# EasyEDA Pro project ProPrj_red-panda-afm_2025-05-21.epro, schematic OPU_Schematic

## Sheets
1 OPU_FPC_Connector: Board Name: OPU_Driver; Create Date: 2024-12-08; Page Name: OPU_FPC_Connector; Project Name: red-panda-afm; Schematic Name: OPU_Schematic; Update Date: 2025-01-25; Company: 嘉立创EDA; Page Size: A4; Version: V1.0
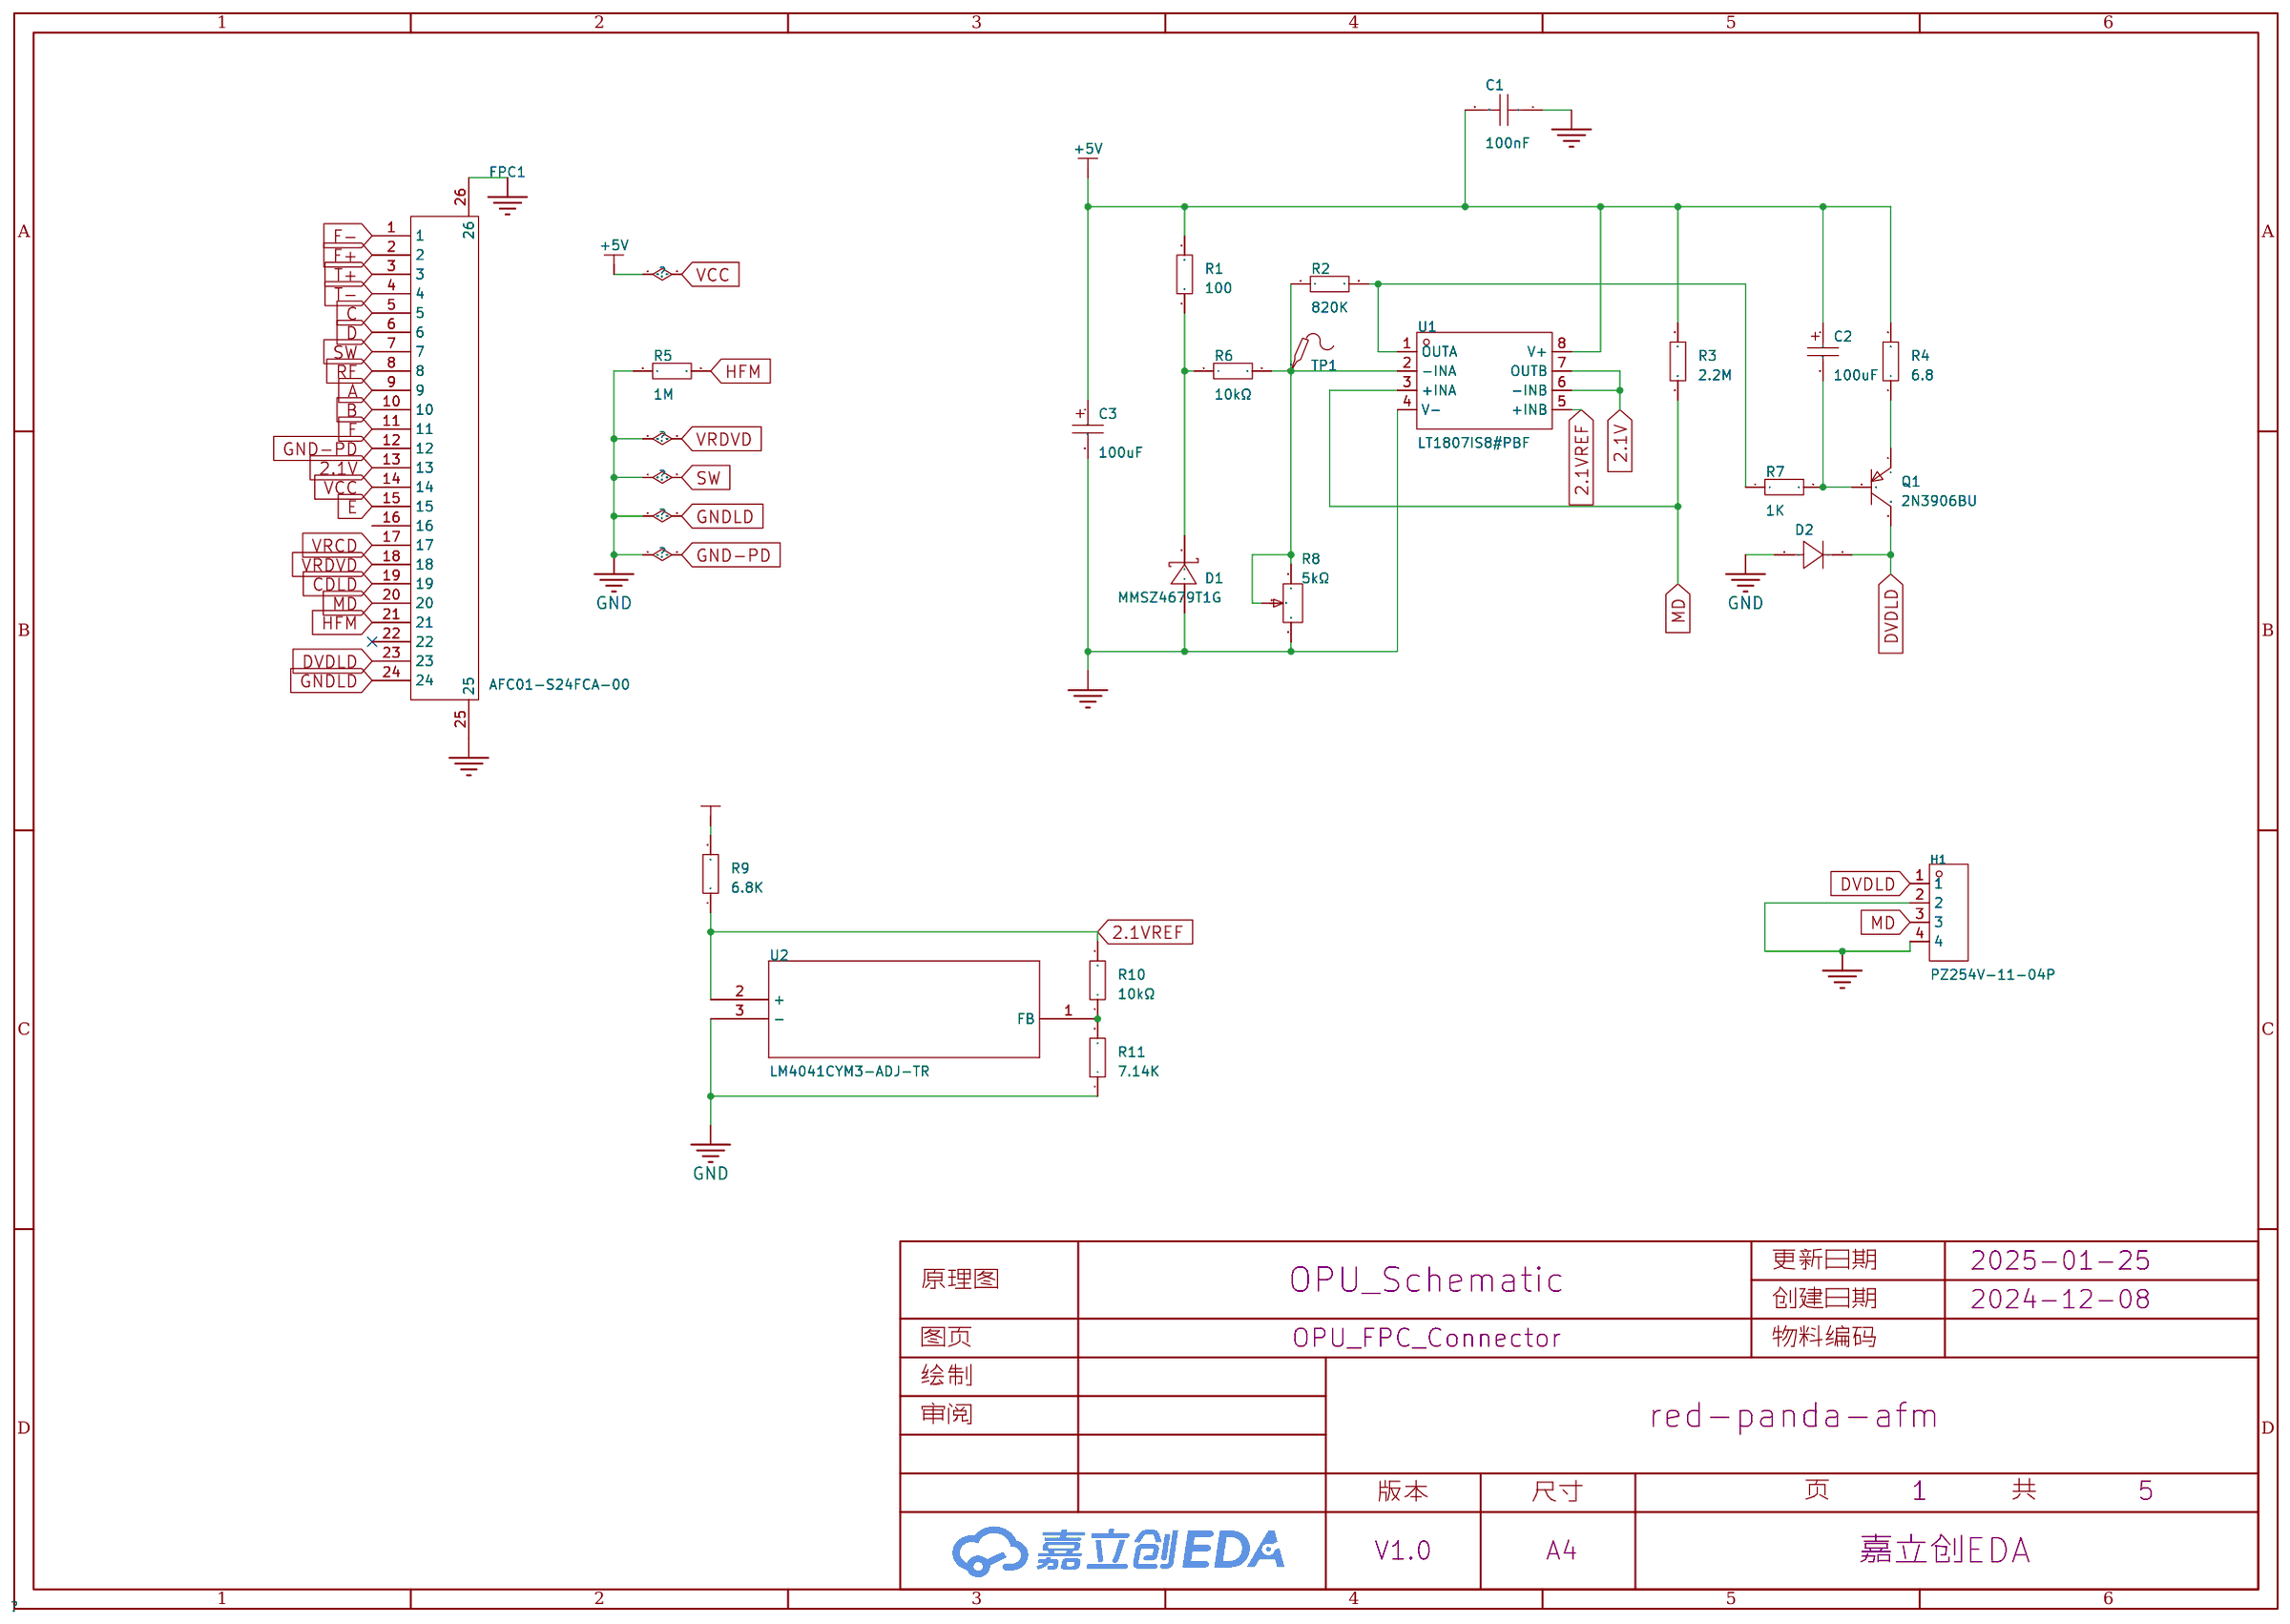
[diagram p4: OPU_FPC_Connector]
2 Voice_Coil_Driver: Page Name: Voice_Coil_Driver; Update Date: 2025-01-12
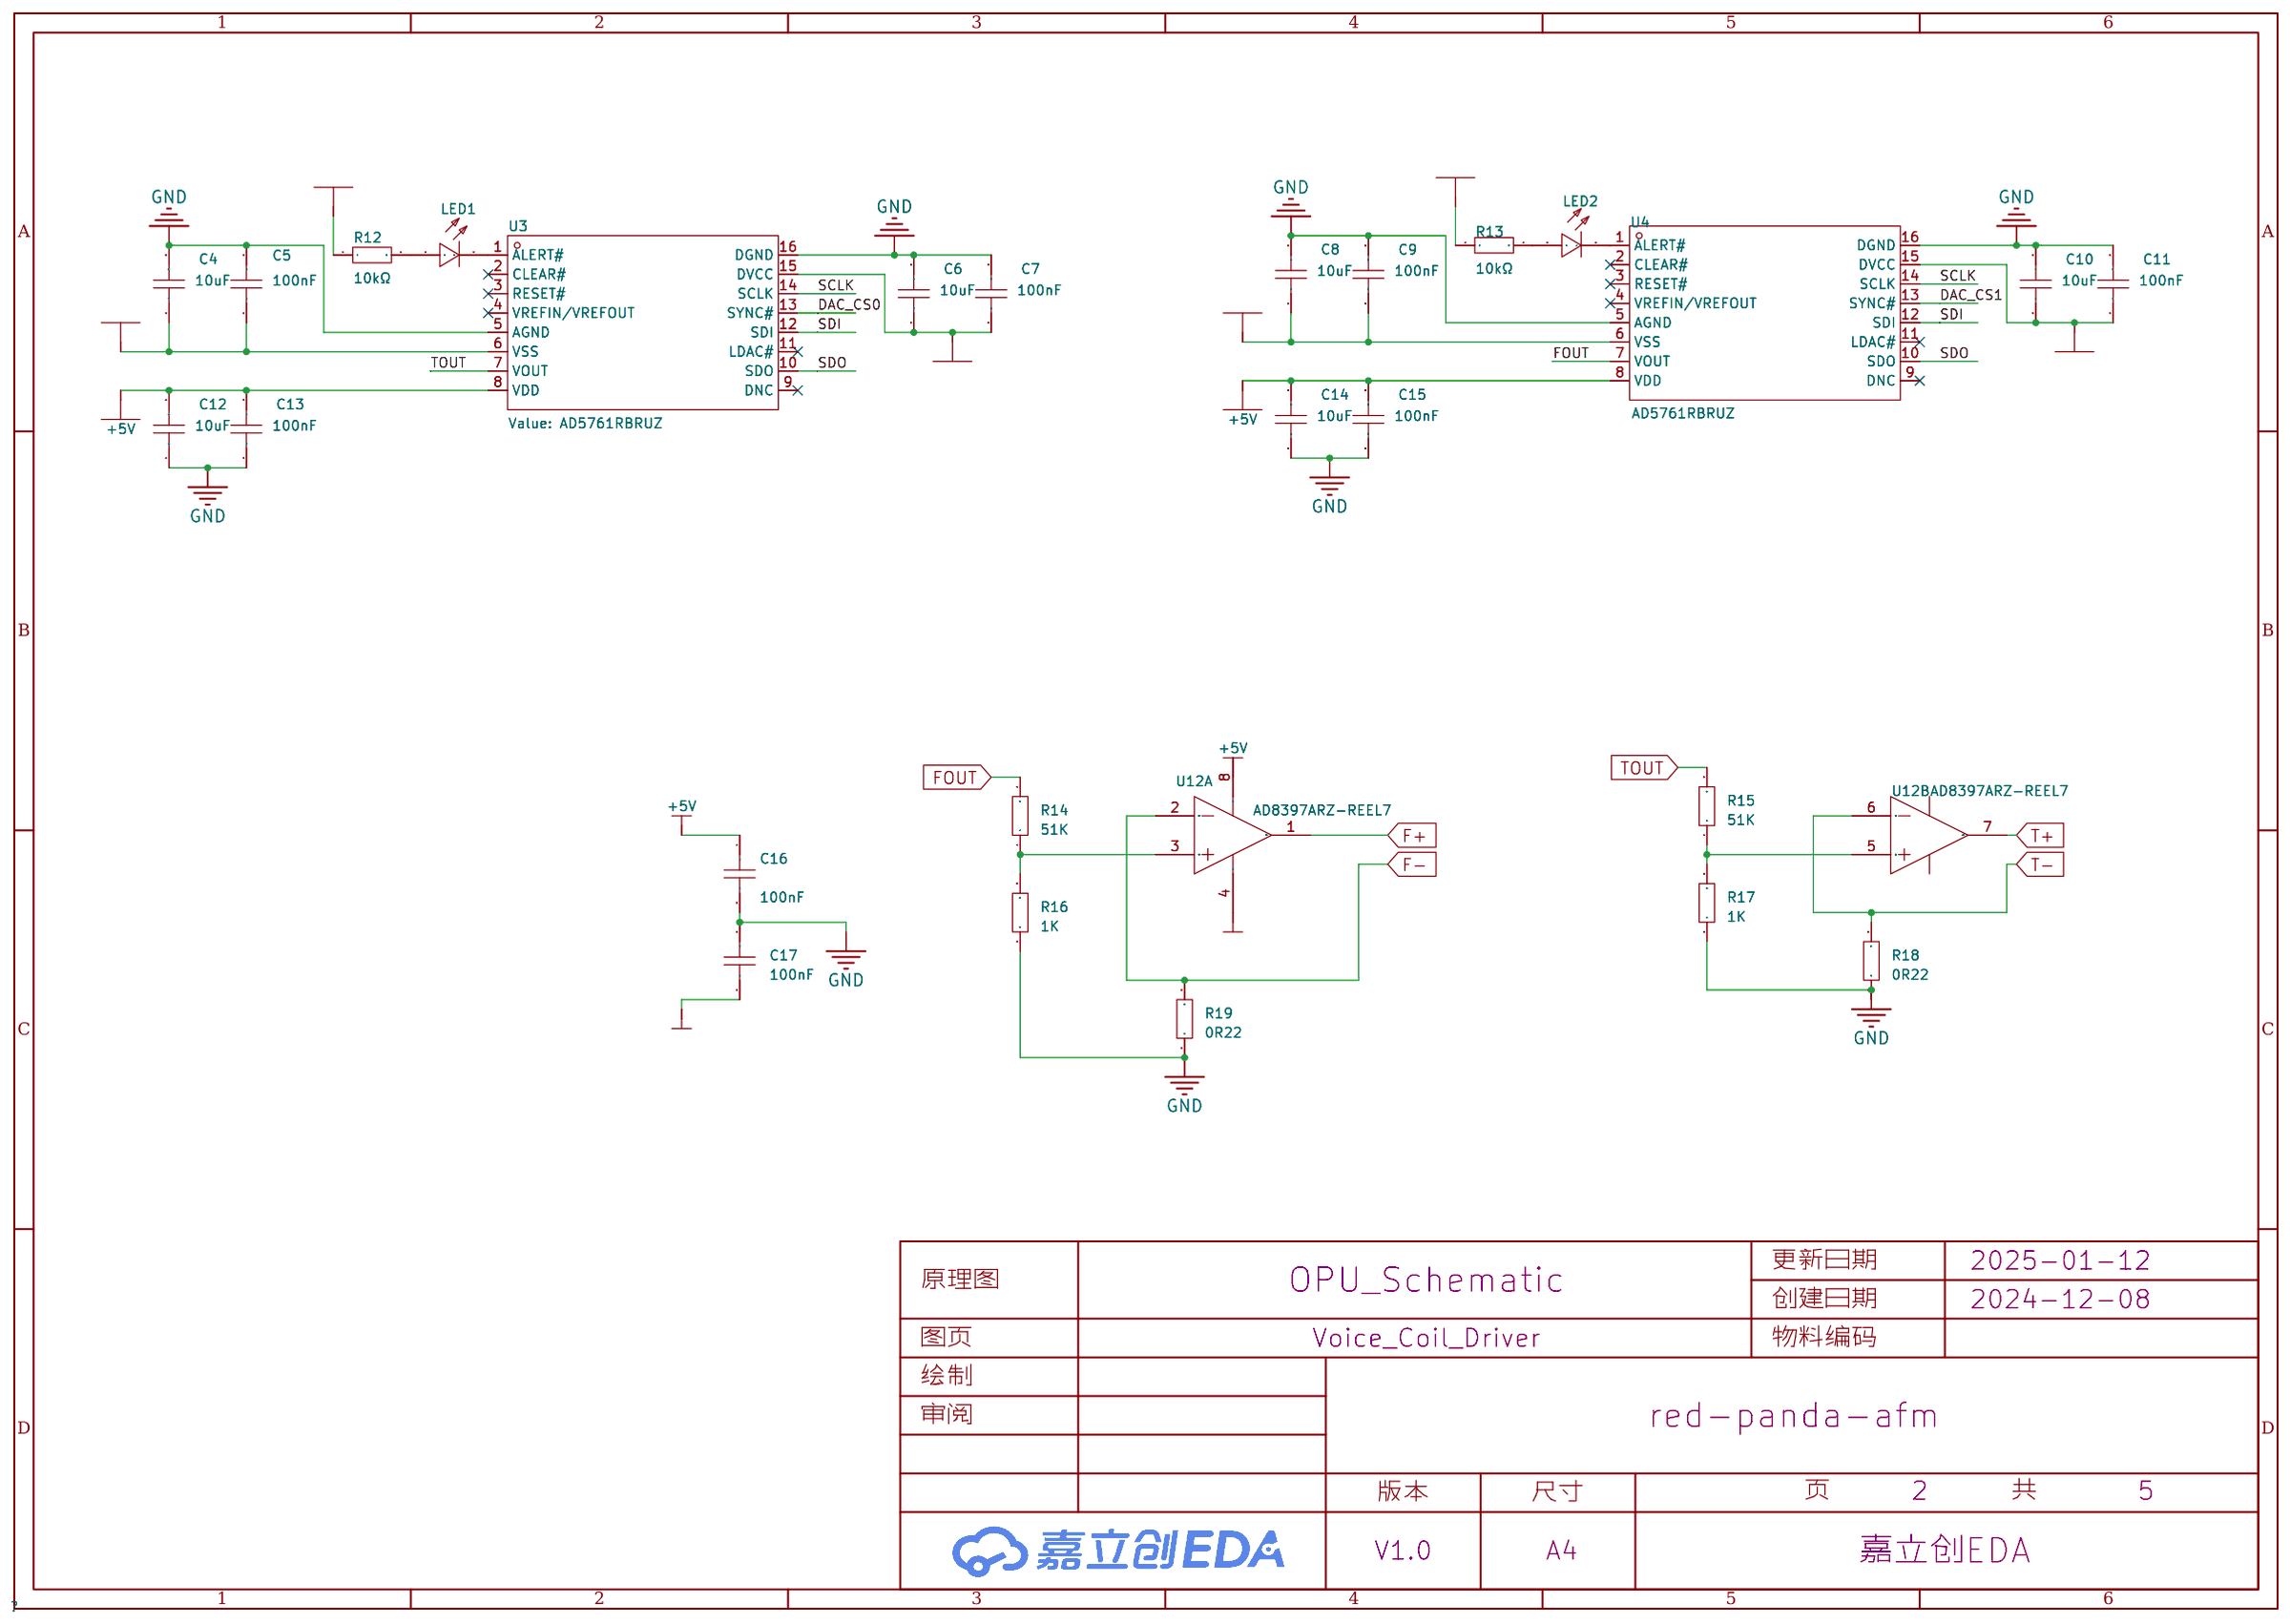
[diagram p5: Voice_Coil_Driver]
3 FocusErr: Page Name: FocusErr; Update Date: 2025-01-20
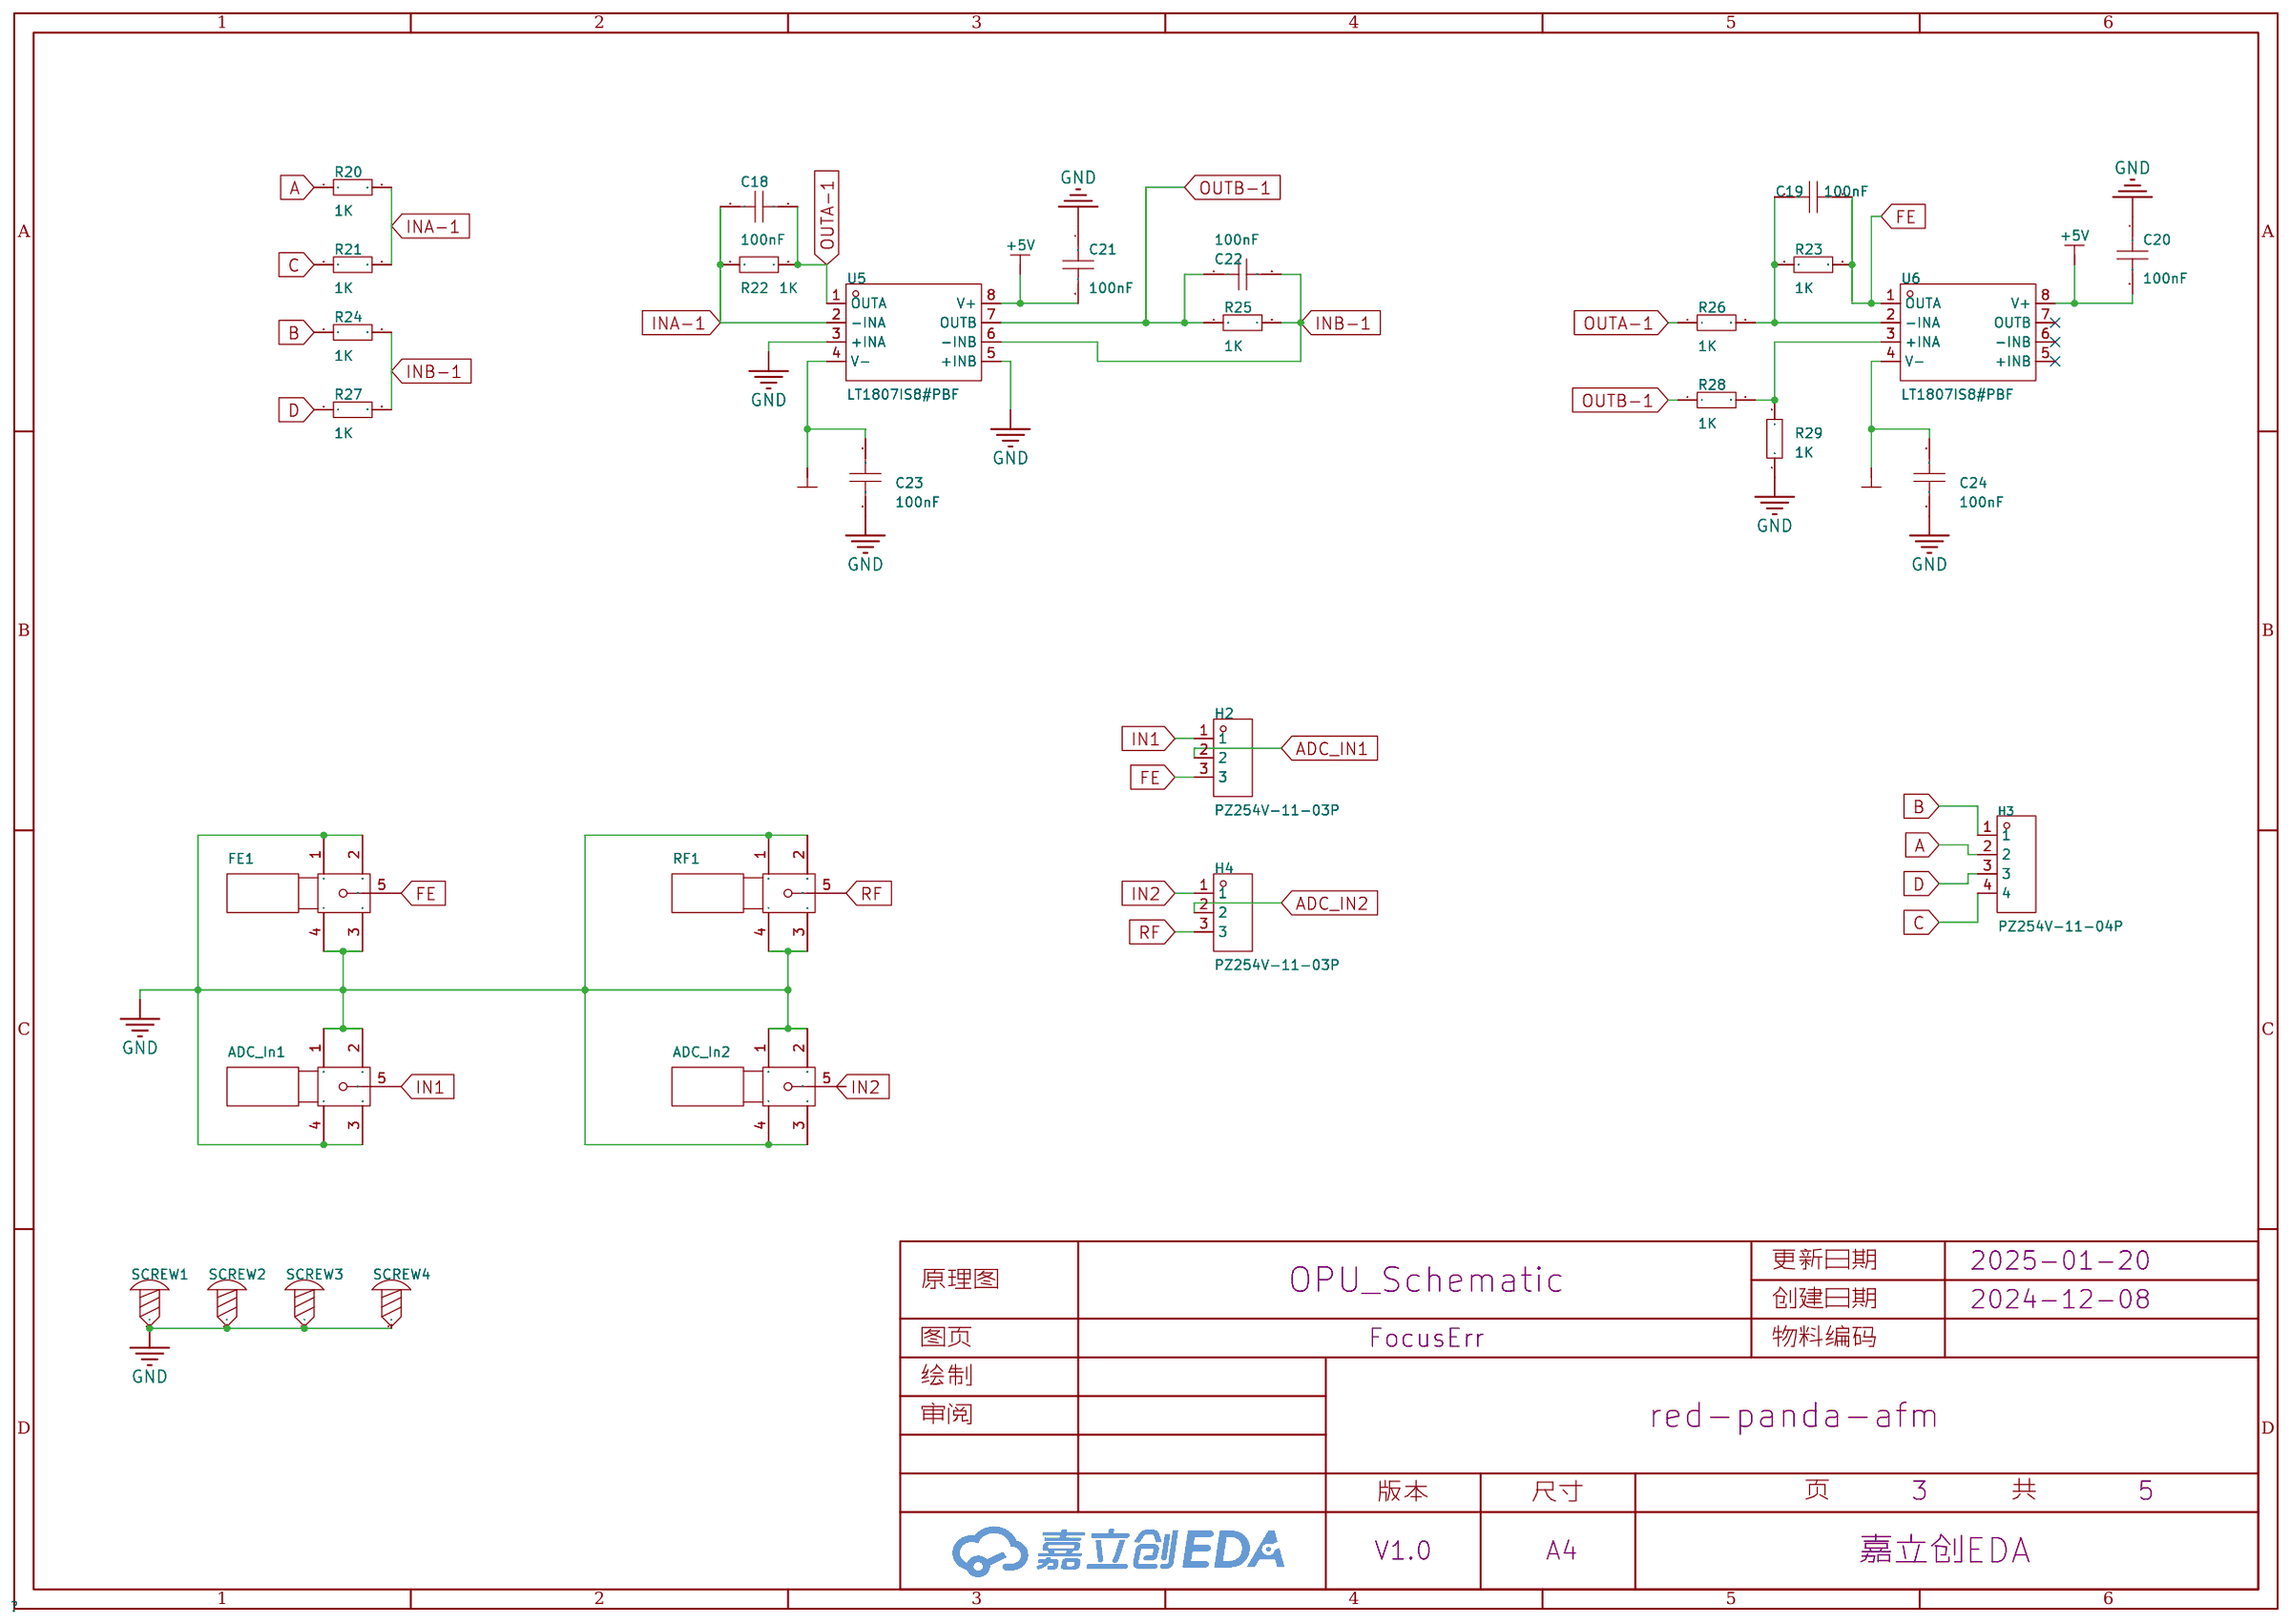
[diagram p6: FocusErr]
4 ADC_Power: Create Date: 2024-12-12; Page Name: ADC_Power; Update Date: 2025-01-20
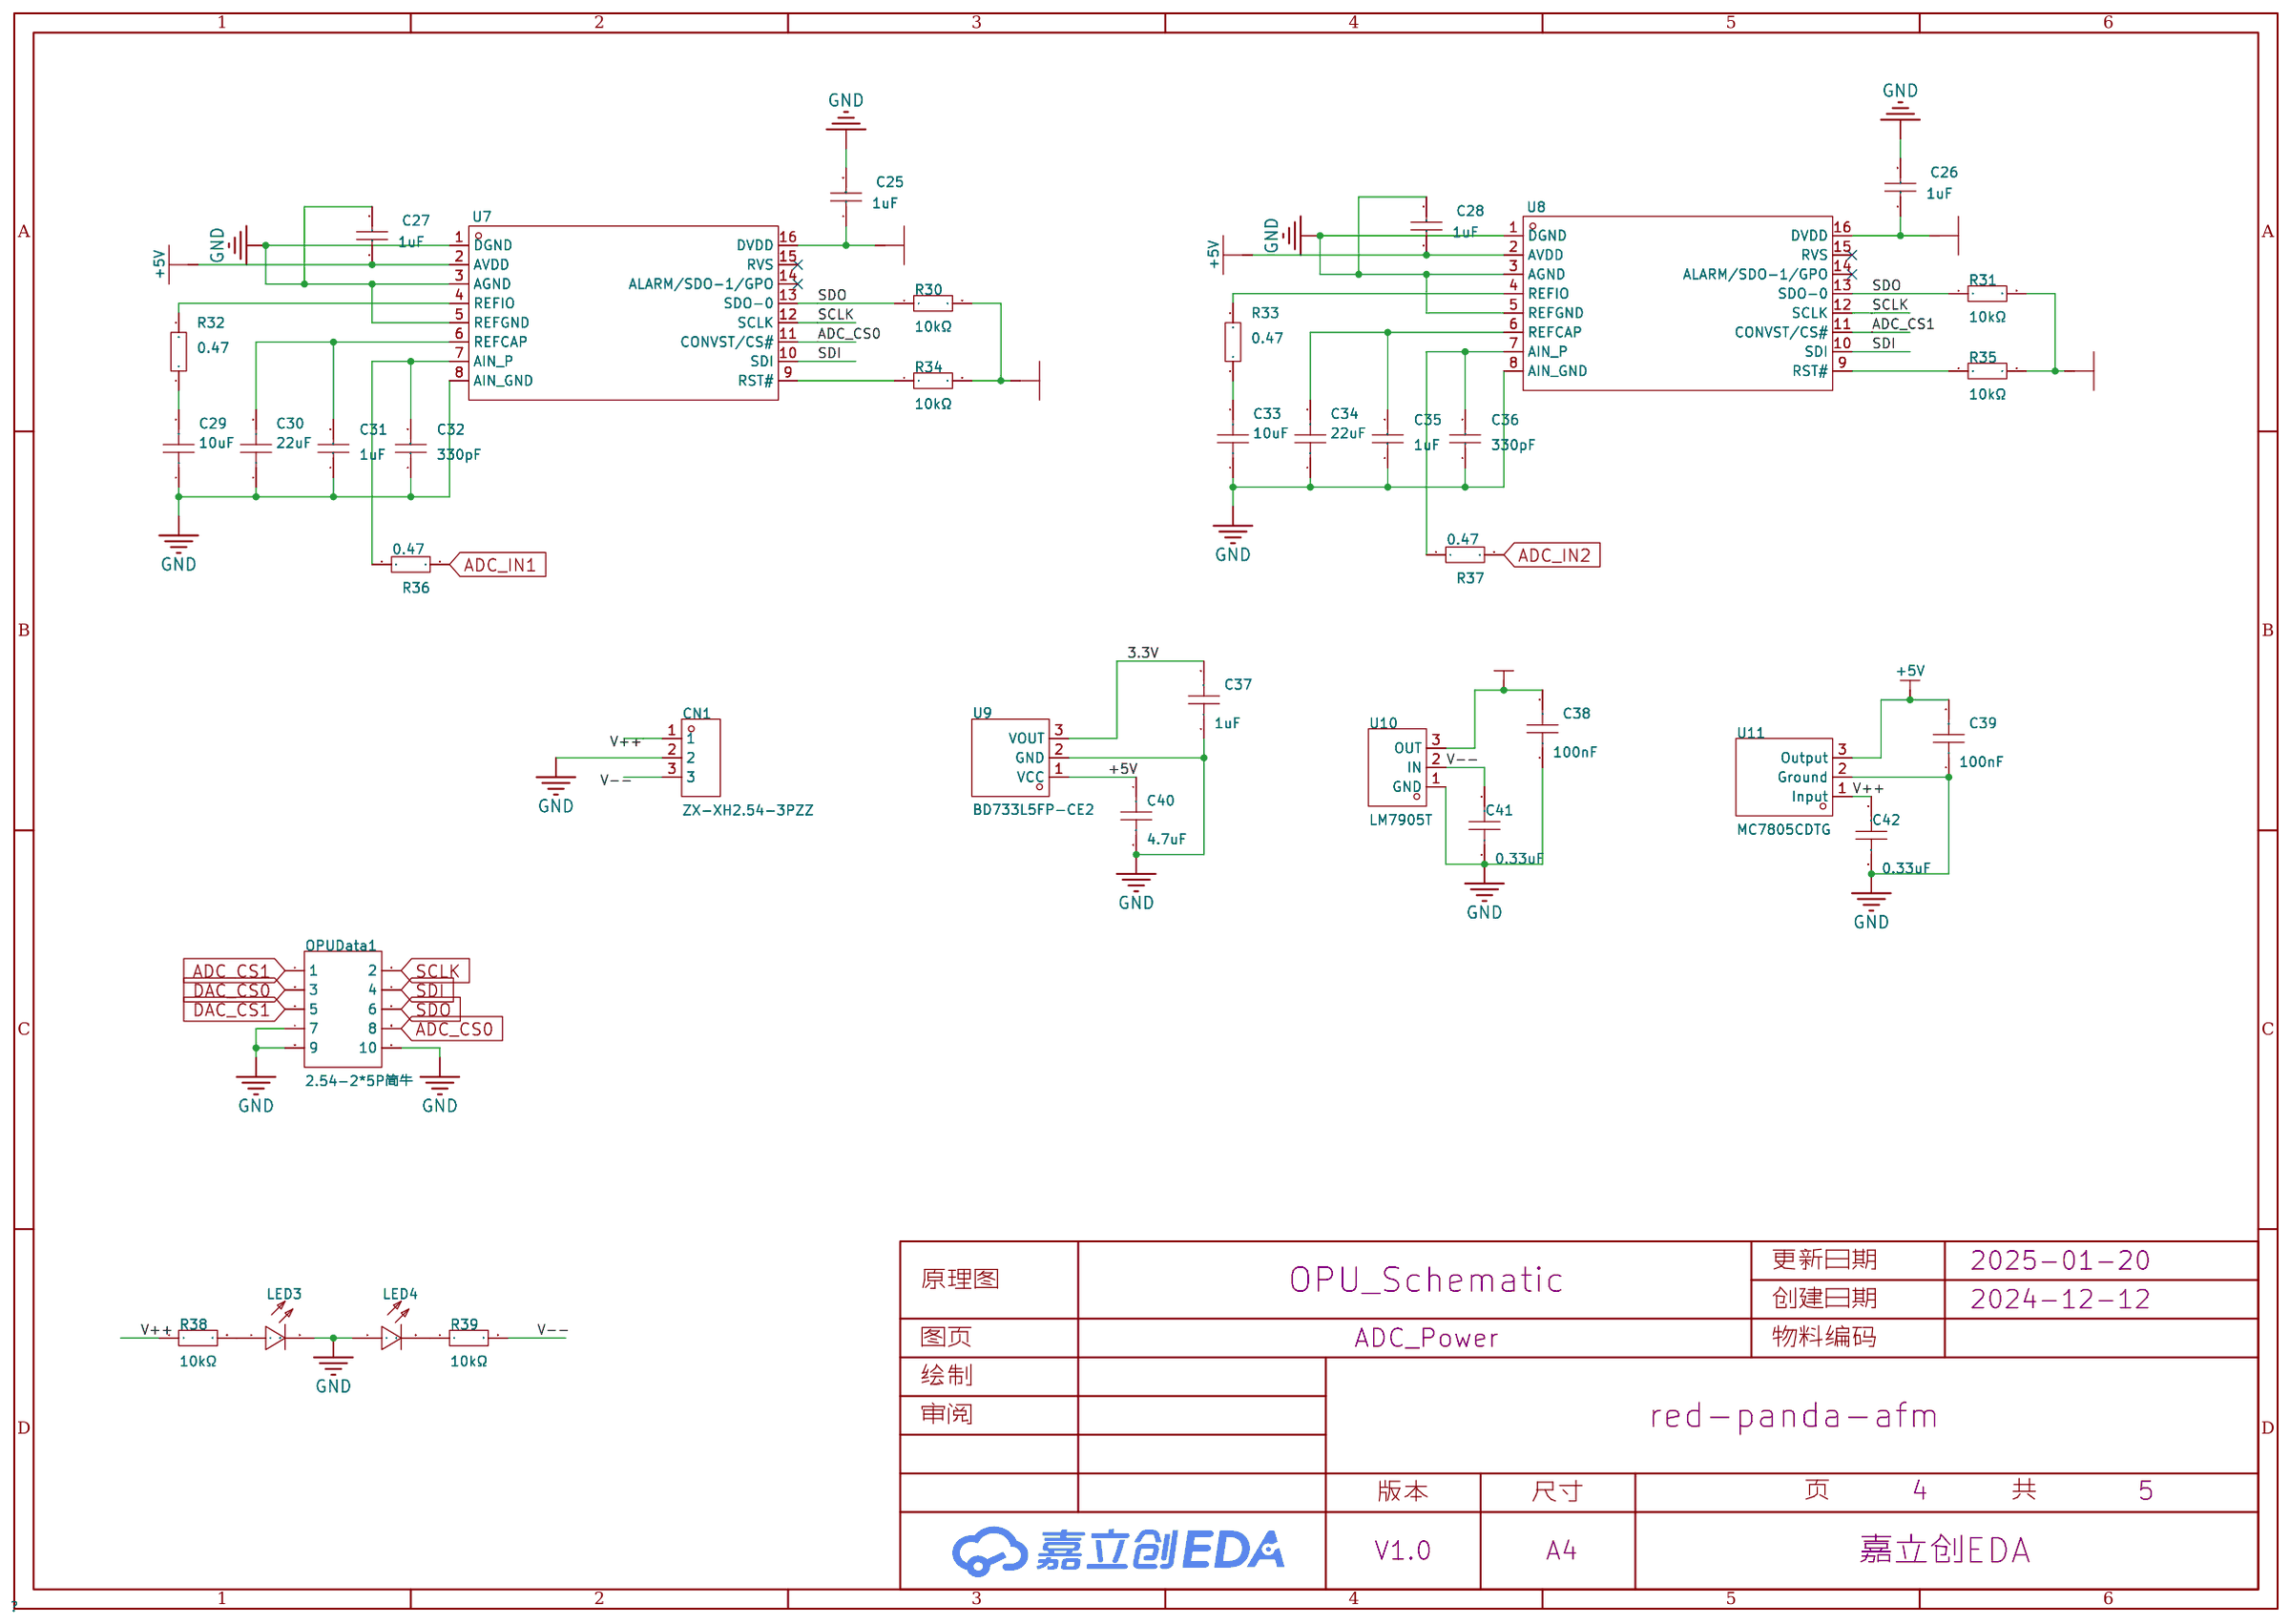
[diagram p7: ADC_Power]

## Parts
sheet ADC_Power
C25  1uF  [C0603]
C26  1uF  [C0603]
C27  1uF  [C0603]
C28  1uF  [C0603]
C29  10uF  [C0603]
C30  22uF  [C0603]
C31  1uF  [C0603]
C32  330pF  [C0603]
C33  10uF  [C0603]
C34  22uF  [C0603]
C35  1uF  [C0603]
C36  330pF  [C0603]
C37  1uF  [C0603]
C38  100nF  [C0603]
C39  100nF  [C0603]
C40  4.7uF  [C0603]
C41  0.33uF  [C0603]
C42  0.33uF  [C0603]
CN1  ZX-XH2.54-3PZZ  [CONN-TH_3P-P2.54_2501S-3P]
LED3  -  [LED0603-R-RD]
LED4  -  [LED0603-R-RD]
OPUData1  2.54-2*5P简牛  [IDC-TH_10P-P2.54_C5665]
R30  10kΩ  [R0603]
R31  10kΩ  [R0603]
R32  0.47  [R0603]
R33  0.47  [R0603]
R34  10kΩ  [R0603]
R35  10kΩ  [R0603]
R36  0.47  [R0603]
R37  0.47  [R0603]
R38  10kΩ  [R0603]
R39  10kΩ  [R0603]
U7  -  [TSSOP-16_L5.0-W4.4-P0.65-LS6.4-TL]
U8  -  [TSSOP-16_L5.0-W4.4-P0.65-LS6.4-TL]
U9  BD733L5FP-CE2  [TO-252-3L_L6.6-W6.1-P4.60-LS9.5-BR-CW]
U10  LM7905T  [TO-220-3_L10.0-W4.5-P2.54-L]
U11  MC7805CDTG  [DPAK_L6.6-W6.2-P2.29-LS9.7-BR]
sheet FocusErr
ADC_In1  -  [SMA-TH_KH-SMA-KE-Z]
ADC_In2  -  [SMA-TH_KH-SMA-KE-Z]
C18  100nF  [C0603]
C19  100nF  [C0603]
C20  100nF  [C0603]
C21  100nF  [C0603]
C22  100nF  [C0603]
C23  100nF  [C0603]
C24  100nF  [C0603]
FE1  -  [SMA-TH_KH-SMA-KE-Z]
H2  PZ254V-11-03P  [HDR-TH_3P-P2.54-V-M]
H3  PZ254V-11-04P  [HDR-TH_4P-P2.54-V-M]
H4  PZ254V-11-03P  [HDR-TH_3P-P2.54-V-M]
R20  1K  [R0603]
R21  1K  [R0603]
R22  1K  [R0603]
R23  1K  [R0603]
R24  1K  [R0603]
R25  1K  [R0603]
R26  1K  [R0603]
R27  1K  [R0603]
R28  1K  [R0603]
R29  1K  [R0603]
RF1  -  [SMA-TH_KH-SMA-KE-Z]
SCREW1  -  [Screw-Hole-M3]
SCREW2  -  [Screw-Hole-M3]
SCREW3  -  [Screw-Hole-M3]
SCREW4  -  [Screw-Hole-M3]
U5  LT1807IS8#PBF  [SOIC-8_L4.9-W3.9-P1.27-LS6.0-BL]
U6  LT1807IS8#PBF  [SOIC-8_L4.9-W3.9-P1.27-LS6.0-BL]
sheet OPU_FPC_Connector
C1  100nF  [C0603]
C2  100uF  [C2917]
C3  100uF  [C2917]
D1  MMSZ4679T1G  [SOD-123_L2.7-W1.6-LS3.7-RD-1]
D2  -  [DO-41_BD2.4-L4.7-P8.70-D0.9-RD]
FPC1  AFC01-S24FCA-00  [FPC-SMD_P0.50-24P_FGS-XJ-H2.0]
H1  PZ254V-11-04P  [HDR-TH_4P-P2.54-V-M]
Q1  2N3906BU  [TO-92-3_L4.8-W3.7-P2.54-L]
R1  100  [R0603]
R2  820K  [R0603]
R3  2.2M  [R0603]
R4  6.8  [R0603]
R5  1M  [R0603]
R6  10kΩ  [R0603]
R7  1K  [R0603]
R8  5kΩ  [RES-ADJ-TH_3296W]
R9  6.8K  [R0603]
R10  10kΩ  [R0603]
R11  7.14K  [R0603]
TP1  -  [Test-Point-0.5mm]
U1  LT1807IS8#PBF  [SOIC-8_L4.9-W3.9-P1.27-LS6.0-BL]
U2  LM4041CYM3-ADJ-TR  [SOT-23_M3_MCH]
sheet Voice_Coil_Driver
C4  10uF  [C0603]
C5  100nF  [C0603]
C6  10uF  [C0603]
C7  100nF  [C0603]
C8  10uF  [C0603]
C9  100nF  [C0603]
C10  10uF  [C0603]
C11  100nF  [C0603]
C12  10uF  [C0603]
C13  100nF  [C0603]
C14  10uF  [C0603]
C15  100nF  [C0603]
C16  100nF  [C0603]
C17  100nF  [C0603]
LED1  -  [LED0603-R-RD]
LED2  -  [LED0603-R-RD]
R12  10kΩ  [R0603]
R13  10kΩ  [R0603]
R14  51K  [R0603]
R15  51K  [R0603]
R16  1K  [R0603]
R17  1K  [R0603]
R18  0R22  [R0603]
R19  0R22  [R0603]
U3  AD5761RBRUZ  [TSSOP-16_L5.0-W4.4-P0.65-LS6.4-TL]
U4  AD5761RBRUZ  [TSSOP-16_L5.0-W4.4-P0.65-LS6.4-TL]
U12  AD8397ARZ-REEL7  [SOIC-8_L4.9-W3.9-P1.27-LS6.0-BL]  (sections 1,2)

## Library data of the parts
C25-C28 C31 C35 = CL10A105KA8NNNC: 容值:1uF;精度:±10%;额定电压:25V;温度系数:X5R;; LCSC Part Name: 1uF ±10% 25V; Supplier Part: C5673; Manufacturer: SAMSUNG(三星); Supplier Footprint: 0603; JLCPCB Part Class: Extended Part; Datasheet: https://atta.szlcsc.com/upload/public/pdf/source/20160103/1457707739994.pdf; Supplier: LCSC; Tolerance: ±10%; Voltage Rated: 25V; Temperature Coefficient: X5R
C4 C6 C8 C10 C12 C14 C29 C33 = GRM188R61E106MA73D: 容值:10uF;精度:±20%;额定电压:25V;温度系数:X5R;; LCSC Part Name: 10uF ±20% 25V; Supplier Part: C91606; Manufacturer: muRata(村田); Supplier Footprint: 0603; JLCPCB Part Class: Extended Part; Datasheet: https://atta.szlcsc.com/upload/public/pdf/source/20161226/1482720176185.pdf; Supplier: LCSC; Tolerance: ±20%; Voltage Rated: 25V; Temperature Coefficient: X5R
C30 C34 = CL10A226MP8NUNE: 容值:22uF;精度:±20%;额定电压:10V;温度系数:X5R;; LCSC Part Name: 22uF ±20% 10V; Supplier Part: C86295; Manufacturer: SAMSUNG(三星); Supplier Footprint: 0603; JLCPCB Part Class: Extended Part; Datasheet: https://atta.szlcsc.com/upload/public/pdf/source/20170325/1490427882169.pdf; Supplier: LCSC; Tolerance: ±20%; Voltage Rated: 10V; Temperature Coefficient: X5R
C32 C36 = CL10C331JB8NNNC: 容值:330pF;精度:±5%;额定电压:50V;温度系数:C0G;; LCSC Part Name: 330pF ±5% 50V; Supplier Part: C1664; Manufacturer: SAMSUNG(三星); Supplier Footprint: 0603; JLCPCB Part Class: Basic Part; Datasheet: https://atta.szlcsc.com/upload/public/pdf/source/20160103/1457707688612.pdf; Supplier: LCSC; Tolerance: ±5%; Voltage Rated: 50V; Temperature Coefficient: C0G
C37 C40-C42 = CAP_0603: Supplier Footprint: 0603
C1 C5 C7 C9 C11 C13 C15-C24 C38 C39 = GCM188R11H104KA42D: Capacitance: Tolerance:±10% Tolerance:±10% Voltage Rated:- Temperature Coefficient:; LCSC Part Name: 100nF ±10%; Supplier Part: C913754; Manufacturer: muRata(村田); Supplier Footprint: 0603; JLCPCB Part Class: Extended Part; Datasheet: https://atta.szlcsc.com/upload/public/pdf/source/20201110/C913436_BC89257AF1CC170DEC759F9C1F15D7BC.pdf; Supplier: LCSC; Tolerance: ±10%
CN1 = ZX-XH2.54-3PZZ: Pins Structure:1x3P Pitch:2.54mm Mounting Style:Straight Reference Series:XH Number of Pins:3P Number of Rows:1 Number of PINs Per Row:3 Row Spacing:- Current Rating (Max):3A Contact Material:Brass Contact Plating:Tin Operating Temperature Range:-25℃~+85℃; Supplier Part: C7429633; Manufacturer: Megastar(兆星); Supplier Footprint: 插件,P=2.54mm; JLCPCB Part Class: Extended Part; Datasheet: https://atta.szlcsc.com/upload/public/pdf/source/20230619/AE17037A2CFDBE8D9CBA775D61AD0A84.pdf; Supplier: LCSC; Pins Structure: 1x3P; Pitch: 2.54mm; Mounting Style: Straight; Reference Series: XH; Number of Pins: 3P; Number of Rows: 1; Number of PINs Per Row: 3; Current Rating (Max): 3A; Contact Material: Brass; Contact Plating: Tin; Operating Temperature Range: -25℃~+85℃
LED1-LED4 = 19-217/R6C-AL1M2VY/3T: 发光颜色:红灯;二极管配置:-;透镜颜色:无色透明;主波长:617.5nm;峰值波长:632nm;色温:-;光通量(25时):-;测试电流:5mA;正向电压(VF):2.2V;发光强度:28.5mcd;功率:60mW;发光角度:120°;安装方式:-;工作温度:-40~+85;; LCSC Part Name: 0603 红灯; Supplier Part: C72044; Manufacturer: EVERLIGHT(台湾亿光); Supplier Footprint: 0603; JLCPCB Part Class: Extended Part; Datasheet: https://atta.szlcsc.com/upload/public/pdf/source/20160507/1462613613821.pdf; Supplier: LCSC; Emitted Color: 红灯; Lens Color: 无色透明; Dominant Wavelength: 617.5nm; Peak Wavelength: 632nm; Forward Current: 5mA; Forward Voltage (VF): 2.2V; Luminous Intensity: 28.5mcd; Power Dissipation: 60mW; Viewing Angle: 120°; Operating Temperature: -40~+85
OPUData1 = 2.54-2*5P简牛: Connector Type:简牛座 Pitch:2.54mm Structure:2x5P Holder Type:Straight Row Spacing:2.54mm Number of Rows:2 Pin Number in each Row:5 Contact Material:- Contact Plating:-; LCSC Part Name: 2.54mm 2x5P 排数:2 每排P数:5; Supplier Part: C5665; Manufacturer: BOOMELE(博穆精密); Supplier Footprint: 插件,P=2.54mm; JLCPCB Part Class: Extended Part; Datasheet: https://atta.szlcsc.com/upload/public/pdf/source/20140331/1457707037896.pdf; Supplier: LCSC; Connector Type: 简牛座; Pitch: 2.54mm; Structure: 2x5P; Holder Type: Straight; Row Spacing: 2.54mm; Number of Rows: 2; Pin Number in each Row: 5
R6 R10 R12 R13 R30 R31 R34 R35 R38 R39 = 0603WAF1002T5E: Type:Thick Film Resistors Resistance:10kΩ Tolerance:±1% Tolerance:±1% Power(Watts): Overload Voltage (Max): Temperature Coefficient:±100ppm/℃ Temperature Coefficient:±100ppm/℃ Operating Temperature Range:-55℃~+155℃ Operating Temperature Range:-55℃~+155℃; LCSC Part Name: 厚膜电阻 10kΩ ±1% 100mW; Supplier Part: C25804; Manufacturer: UNI-ROYAL(厚声); Supplier Footprint: 0603; JLCPCB Part Class: Basic Part; Datasheet: https://atta.szlcsc.com/upload/public/pdf/source/20200306/C422600_1E6D84923E4A46A82E41ADD87F860B5C.pdf; Supplier: LCSC; Type: Thick Film Resistors; Tolerance: ±1%; Temperature Coefficient: ±100ppm/℃; Operating Temperature Range: -55℃~+155℃
R32 R33 R36 R37 = RL0603FR-070R47L: 阻值:0.47;精度:±1%;功率:100mW;温度系数:±800ppm/;; LCSC Part Name: 0.47 ±1% 100mW; Supplier Part: C326953; Manufacturer: YAGEO(国巨); Supplier Footprint: 0603; JLCPCB Part Class: Extended Part; Datasheet: https://atta.szlcsc.com/upload/public/pdf/source/20181031/C326953_2A06D5EACD581F8EE6DB7FFE6C5B8872.pdf; Supplier: LCSC; Tolerance: ±1%; Power(Watts): 100mW; Temperature Coefficient: ±800ppm/
U7 U8 = ADS8685IPWR: A/D 位数:-;采样率（sps）:-;输入数:-;输入类型:-;; Supplier Part: C2669941; Manufacturer: TI(德州仪器); Supplier Footprint: TSSOP-16; JLCPCB Part Class: Extended Part; Supplier: LCSC
U9 = BD733L5FP-CE2: Supplier Part: C509724; Manufacturer: ROHM(罗姆); Supplier Footprint: TO-252-3; JLCPCB Part Class: Extended Part; Datasheet: https://atta.szlcsc.com/upload/public/pdf/source/20230201/396DA52F76B265AFAA10405709CD3C0A.pdf; Supplier: LCSC
U10 = LM7905T: Output Voltage:5V Output Voltage:5V; Supplier Part: C2926293; Manufacturer: HGSEMI(华冠); Supplier Footprint: TO-220-3; JLCPCB Part Class: Extended Part; Datasheet: https://atta.szlcsc.com/upload/public/pdf/source/20220921/D54579C407B8098A57F5285C42DC4416.pdf; Supplier: LCSC; Output Voltage: 5V
U11 = MC7805CDTG: LCSC Part Name: 线性电压稳压器，1 A，5 至 24 V，正向; Supplier Part: C897464; Manufacturer: onsemi(安森美); Supplier Footprint: DPAK; JLCPCB Part Class: Extended Part; Datasheet: https://atta.szlcsc.com/upload/public/pdf/source/20221020/B822C9350C81A84B74CC7C0C15A8E182.pdf; Supplier: LCSC
ADC_In1 ADC_In2 FE1 RF1 = KH-SMA-KE-Z: 连接器类型:板端;射频系列:SMA;接口类型:内孔;端口数量:1;阻抗:-;频率-最大值:-;样式:正脚;接口直径:6.2mm;接口长度/高度:8mm;工作温度范围:-;; LCSC Part Name: SMA 内孔 正脚 镀金半牙H=8MM; Supplier Part: C504007; Manufacturer: kinghelm(金航标); Supplier Footprint: 插件; JLCPCB Part Class: Extended Part; Datasheet: https://atta.szlcsc.com/upload/public/pdf/source/20200330/C504007_C31FA59B5EDC95FA4ACB3324B1A20151.pdf; Supplier: LCSC; Connector Type: 板端; RF Series: SMA; Interface Type: 内孔; Number of Ports: 1; Style: 正脚; Interface Diameter: 6.2mm; Interface Length/Height: 8mm
H2 H4 = PZ254V-11-03P: Pin Structure:1x3P Pitch:2.54mm Row Spacing:- Circluar Pins/Square Pins:Square Pins Mounting Type:Straight Number of Rows:Plugin Number of Pins:3P Current Rating (Max):3A Voltage Rating (Max):250V Length of Mating Pin:6mm Insulation Height:2.5mm Length of; LCSC Part Name: 间距:2.54mm 1x3P 直插 方针; Supplier Part: C2937625; Manufacturer: XFCN(兴飞); Supplier Footprint: 插件,P=2.54mm; JLCPCB Part Class: Extended Part; Datasheet: https://atta.szlcsc.com/upload/public/pdf/source/20200309/C492402_8335C3D49C4E4C618838D59BB1D024C1.pdf; Supplier: LCSC; Pin Structure: 1x3P; Pitch: 2.54mm; Circluar Pins/Square Pins: Square Pins; Mounting Type: Straight; Number of Rows: Plugin; Number of Pins: 3P; Current Rating (Max): 3A; Voltage Rating (Max): 250V; Length of Mating Pin: 6mm; Insulation Height: 2.5mm; Length of End Connection Pin: 3mm; Operating Temperature Range: -40℃~+105℃; Color: Black
H1 H3 = PZ254V-11-04P: Pin Structure:1x4P Pitch:2.54mm Row Spacing:- Circluar Pins/Square Pins:Square Pins Mounting Type:Straight Number of Rows:Plugin Number of Pins:4P Current Rating (Max):3A Voltage Rating (Max):250V Length of Mating Pin:6mm Insulation Height:2.5mm Length of; LCSC Part Name: 间距:2.54mm 1x4P 直插 方针; Supplier Part: C2691448; Manufacturer: XFCN(兴飞); Supplier Footprint: 插件,P=2.54mm; JLCPCB Part Class: Extended Part; Datasheet: https://atta.szlcsc.com/upload/public/pdf/source/20200309/C492403_F9F19131791D08044AD4F84F8E751A34.pdf; Supplier: LCSC; Pin Structure: 1x4P; Pitch: 2.54mm; Circluar Pins/Square Pins: Square Pins; Mounting Type: Straight; Number of Rows: Plugin; Number of Pins: 4P; Current Rating (Max): 3A; Voltage Rating (Max): 250V; Length of Mating Pin: 6mm; Insulation Height: 2.5mm; Length of End Connection Pin: 3mm; Operating Temperature Range: -40℃~+105℃; Color: Black
R1-R5 R7 R9 R11 R14-R29 = Res_0603: Supplier Footprint: 0603
SCREW1-SCREW4 = Screw-Hole-M3: Supplier Footprint: 插件
U1 U5 U6 = LT1807IS8#PBF: Number of Circuits:双路 Gain Bandwidth Product(GBP):325MHz Current - Input Bias(Ib):1uA Slew Rate(SR):140V/us Output Current:85mA Output Type:- Rail to Rail:- Operating Temperature:-40℃~+85℃ Operating Temperature:-40℃~+85℃; Supplier Part: C665381; Manufacturer: ADI(亚德诺); Supplier Footprint: SOIC-8; JLCPCB Part Class: Extended Part; Datasheet: https://atta.szlcsc.com/upload/public/pdf/source/20200701/C665369_CCAA0347C2AF7A448F3B38ED65269E1E.pdf; Supplier: LCSC; Number of Circuits: 双路; Gain Bandwidth Product(GBP): 325MHz; Current - Input Bias(Ib): 1uA; Slew Rate(SR): 140V/us; Output Current: 85mA; Operating Temperature: -40℃~+85℃
C2 C3 = TAJB107K006RNJ: 容值:100uF;精度:±10%;额定电压:6.3V;等效串联电阻:1.7Ω@100kHz;; LCSC Part Name: 100uF ±10% 6.3V; Supplier Part: C16133; Manufacturer: Kyocera AVX; Supplier Footprint: CASE-B-3528-21(mm); JLCPCB Part Class: Basic Part; Datasheet: https://atta.szlcsc.com/upload/public/pdf/source/20160107/1457707750344.pdf; Supplier: LCSC; Tolerance: ±10%; Rated Voltage: 6.3V; Equivalent Series Resistance(ESR): 1.7Ω@100kHz; Operating Temperature: -55℃~+125℃
D1 = MMSZ4679T1G: Diode Configuration:Independent Type Zener Voltage (Nom):2V Reverse Leakage Current (Ir):5uA@1V Zener Voltage (Range):1.9V~2.1V Zener Voltage (Range):1.9V~2.1V Power Dissipation:500mW Zener Impedance (Zzt):-; Supplier Part: C236096; Manufacturer: onsemi(安森美); Supplier Footprint: SOD-123; JLCPCB Part Class: Extended Part; Datasheet: https://atta.szlcsc.com/upload/public/pdf/source/20190903/C236096_7D7272416DE154F9B2400A6A9634F1EE.pdf; Supplier: LCSC; Diode Configuration: Independent Type; Zener Voltage (Nom): 2V; Reverse Leakage Current (Ir): 5uA@1V; Zener Voltage (Range): 1.9V~2.1V; Power Dissipation: 500mW
D2 = 1N4007: Supplier Footprint: DO-41
FPC1 = AFC01-S24FCA-00: 锁定特性:翻盖式;触点类型:下接;触点数量:24P;间距:0.5mm;安装类型:卧贴;; LCSC Part Name: 间距:0.5mm P数:24P 翻盖式 下接; Supplier Part: C262669; Manufacturer: JS(钜硕电子); Supplier Footprint: SMD,P=0.5mm,卧贴; JLCPCB Part Class: Extended Part; Datasheet: https://atta.szlcsc.com/upload/public/pdf/source/20190816/C413942_2A72D1AC756EAE17EEDF756A339D4500.pdf; Supplier: LCSC; Locking Feature: 翻盖式; Contact Type: 下接; Number of Contacts: 24P; Pitch: 0.5mm; Mounting Type: 卧贴; FFC, FCB Thickness: 0.3mm; Height Above Board: 2mm
Q1 = 2N3906BU: 晶体管类型:PNP;集电极电流(Ic):200mA;集射极击穿电压(Vceo):40V;功率(Pd):625mW;直流电流增益(hFE@Ic,Vce):100@10mA,1.0V;; LCSC Part Name: PNP 电流:200mA 耐压:40V; Supplier Part: C124483; Manufacturer: onsemi(安森美); Supplier Footprint: TO-92-3; JLCPCB Part Class: Extended Part; Datasheet: https://atta.szlcsc.com/upload/public/pdf/source/20170804/C124483_1501836270112866294.pdf; Supplier: LCSC; Transistor Type: PNP; Collector Current (Ic): 200mA; Collector-Emitter Breakdown Voltage (Vceo): 40V; Power Dissipation (Pd): 625mW; DC Current Gain (hFE@Ic,Vce): 100@10mA,1.0V; Transition Frequency (fT): 250MHz; Collector Cut-Off Current (Icbo): 50nA; Collector-Emitter Saturation Voltage (VCE(sat)@Ic,Ib): 250mV@10mA,1.0mA; Operating Temperature: -55℃~+150℃
R8 = 3296W-1-502LF: 阻值:5kΩ;精度:±10%;; LCSC Part Name: 5kΩ ±10%; Supplier Part: C60620; Manufacturer: BOURNS; Supplier Footprint: SIP-3P,9.5x4.8mm; JLCPCB Part Class: Extended Part; Datasheet: https://atta.szlcsc.com/upload/public/pdf/source/20180326/C111793_7BE3639881F18EA7BF3D269EDA80A489.pdf; Supplier: LCSC; Tolerance: ±10%
TP1 = Test-Point: Test Point 测试点
U2 = LM4041CYM3-ADJ-TR
U3 U4 = AD5761RBRUZ: D/A 位数:-;D/A通道数:-;输出类型:-;读写接口类型:-;; Supplier Part: C404015; Manufacturer: ADI(亚德诺)/LINEAR; Supplier Footprint: TSSOP-16; JLCPCB Part Class: Extended Part; Datasheet: https://atta.szlcsc.com/upload/public/pdf/source/20190722/C404015_21C88E48C88813C7B0010A18F7ED8816.pdf; Supplier: LCSC
U12 = AD8397ARZ-REEL7: LCSC Part Name: 双通道轨到轨输出运算放大器; Supplier Part: C521305; Manufacturer: ADI(亚德诺); Supplier Footprint: SOIC-8; JLCPCB Part Class: Extended Part; Datasheet: https://atta.szlcsc.com/upload/public/pdf/source/20191204/C90876_4AF00728A23BB3AF24EDE9E3A75C9AF8.pdf; Supplier: LCSC

## Nets
2.1V: FPC1.13 U1.6(-INB) U1.7(OUTB)
2.1VREF: R9.1 R10.2 U1.5(+INB) U2.2(+)
3.3V: C6.1 C7.1 C10.1 C11.1 C25.1 C26.1 C37.2 R12.1 R13.1 R30.2 R31.2 R34.2 R35.2 U3.15(DVCC) U4.15(DVCC) U7.16(DVDD) U8.16(DVDD) U9.3(VOUT)
+5V: C1.2 C2.1 C3.1 C12.2 C13.2 C14.2 C15.2 C16.1 C20.2 C21.2 C27.1 C28.1 C39.2 C40.1 FPC1.14 R1.2 R3.2 R4.2 R9.2 U1.8(V+) U3.8(VDD) U4.8(VDD) U5.8(V+) U6.8(V+) U7.2(AVDD) U8.2(AVDD) U9.1(VCC) U11.3(Output) U12.8(+VS)
-5V: C4.1 C5.1 C8.1 C9.1 C17.1 C23.2 C24.2 C38.2 U3.6(VSS) U4.6(VSS) U5.4(V-) U6.4(V-) U10.3(OUT) U12.4(-VS)
GND: ADC_In1.1 ADC_In1.2 ADC_In1.3 ADC_In1.4 ADC_In2.1 ADC_In2.2 ADC_In2.3 ADC_In2.4 C1.1 C3.2 C4.2 C5.2 C6.2 C7.2 C8.2 C9.2 C10.2 C11.2 C12.1 C13.1 C14.1 C15.1 C16.2 C17.2 C20.1 C21.1 C23.1 C24.1 C25.2 C26.2 C27.2 C28.2 C29.1 C30.1 C31.1 C32.1 C33.1 C34.1 C35.1 C36.1 C37.1 C38.1 C39.1 C40.2 C41.2 C42.2 CN1.2 D1.2(A) D2.2(A) FE1.1 FE1.2 FE1.3 FE1.4 FPC1.7 FPC1.12 FPC1.18 FPC1.24 FPC1.25 FPC1.26 H1.2 H1.4 LED3.2(C) LED4.1(A) OPUData1.7 OPUData1.9 OPUData1.10 R5.2 R8.3 R11.1 R16.1 R17.1 R18.1 R19.1 R29.1 RF1.1 RF1.2 RF1.3 RF1.4 SCREW1.1 SCREW2.1 SCREW3.1 SCREW4.1 U1.4(V-) U2.3(-) U3.5(AGND) U3.16(DGND) U4.5(AGND) U4.16(DGND) U5.3(+INA) U5.5(+INB) U7.1(DGND) U7.3(AGND) U7.5(REFGND) U7.8(AIN_GND) U8.1(DGND) U8.3(AGND) U8.5(REFGND) U8.8(AIN_GND) U9.2(GND) U10.1(GND) U11.2(Ground)
A: FPC1.9 H3.2 R20.1
ADC_CS0: OPUData1.8 U7.11(CONVST/CS#)
ADC_CS1: OPUData1.1 U8.11(CONVST/CS#)
ADC_IN1: H2.2 R36.2
ADC_IN2: H4.2 R37.2
B: FPC1.10 H3.1 R24.1
C: FPC1.5 H3.4 R21.1
CDLD: FPC1.19
D: FPC1.6 H3.3 R27.1
DAC_CS0: OPUData1.3 U3.13(SYNC#)
DAC_CS1: OPUData1.5 U4.13(SYNC#)
DVDLD: D2.1(K) FPC1.23 H1.1 Q1.3(C)
E: FPC1.15
F: FPC1.11
F+: FPC1.2 U12.1(OUT1)
F-: FPC1.1 R19.2 U12.2(IN1-)
FE: C19.1 FE1.5 H2.3 R23.2 U6.1(OUTA)
FOUT: R14.2 U4.7(VOUT)
HFM: FPC1.21 R5.1
IN1: ADC_In1.5 H2.1
IN2: ADC_In2.5 H4.1
INA-1: C18.2 R20.2 R21.2 R22.1 U5.2(-INA)
INB-1: C22.2 R24.2 R25.2 R27.2 U5.6(-INB)
MD: FPC1.20 H1.3 R3.1 U1.3(+INA)
OUTA-1: C18.1 R22.2 R26.1 U5.1(OUTA)
OUTB-1: C22.1 R25.1 R28.1 U5.7(OUTB)
RF: FPC1.8 H4.3 RF1.5
SCLK: OPUData1.2 U3.14(SCLK) U4.14(SCLK) U7.12(SCLK) U8.12(SCLK)
SDI: OPUData1.4 U3.12(SDI) U4.12(SDI) U7.10(SDI) U8.10(SDI)
SDO: OPUData1.6 R30.1 R31.1 U3.10(SDO) U4.10(SDO) U7.13(SDO-0) U8.13(SDO-0)
T+: FPC1.3 U12.7(OUT2)
T-: FPC1.4 R18.2 U12.6(IN2-)
TOUT: R15.2 U3.7(VOUT)
V++: C42.1 CN1.1 R38.1 U11.1(Input)
V--: C41.1 CN1.3 R39.2 U10.2(IN)
VRCD: FPC1.17
VREF: R10.1 R11.2 U2.1(FB)
$1N1382: Q1.1(E) R4.1
$1N1385: C2.2 Q1.2(B) R7.2
$1N7976: D1.1(K) R1.1 R6.1
$1N7980: R2.1 R6.2 R8.1 R8.2 TP1.1 U1.2(-INA)
$1N9531: R2.2 R7.1 U1.1(OUTA)
$3N416: R14.1 R16.2 U12.3(IN1+)
$3N901: R15.1 R17.2 U12.5(IN2+)
$3N2421: LED2.2(C) U4.1(ALERT#)
$3N2422: LED2.1(A) R13.2
$3N2440: LED1.2(C) U3.1(ALERT#)
$3N2441: LED1.1(A) R12.2
$4N1135: C19.2 R23.1 R26.2 U6.2(-INA)
$4N1234: R28.2 R29.2 U6.3(+INA)
$6N539: R32.2 U7.4(REFIO)
$6N540: C29.2 R32.1
$6N541: C30.2 C31.2 U7.6(REFCAP)
$6N553: R34.1 U7.9(RST#)
$6N555: C32.2 R36.1 U7.7(AIN_P)
$6N1064: R33.2 U8.4(REFIO)
$6N1065: C33.2 R33.1
$6N1066: C34.2 C35.2 U8.6(REFCAP)
$6N1078: R35.1 U8.9(RST#)
$6N1080: C36.2 R37.1 U8.7(AIN_P)
$6N3346: LED3.1(A) R38.2
$6N3348: LED4.2(C) R39.1

Not connected (* = marked no-connect by the designer): FPC1 16 22*; U3 2(CLEAR#)* 3(RESET#)* 4(VREFIN/VREFOUT)* 9(DNC)* 11(LDAC#)*; U4 2(CLEAR#)* 3(RESET#)* 4(VREFIN/VREFOUT)* 9(DNC)* 11(LDAC#)*; U6 5(+INB)* 6(-INB)* 7(OUTB)*; U7 14(ALARM/SDO-1/GPO)* 15(RVS)*; U8 14(ALARM/SDO-1/GPO)* 15(RVS)*
